# Altium schematic sheet SmartyBoy.SchDoc: SmartyBoy Block Diagram
size A4; DocumentNumber: 1; SheetNumber: 1; SheetTotal: 11
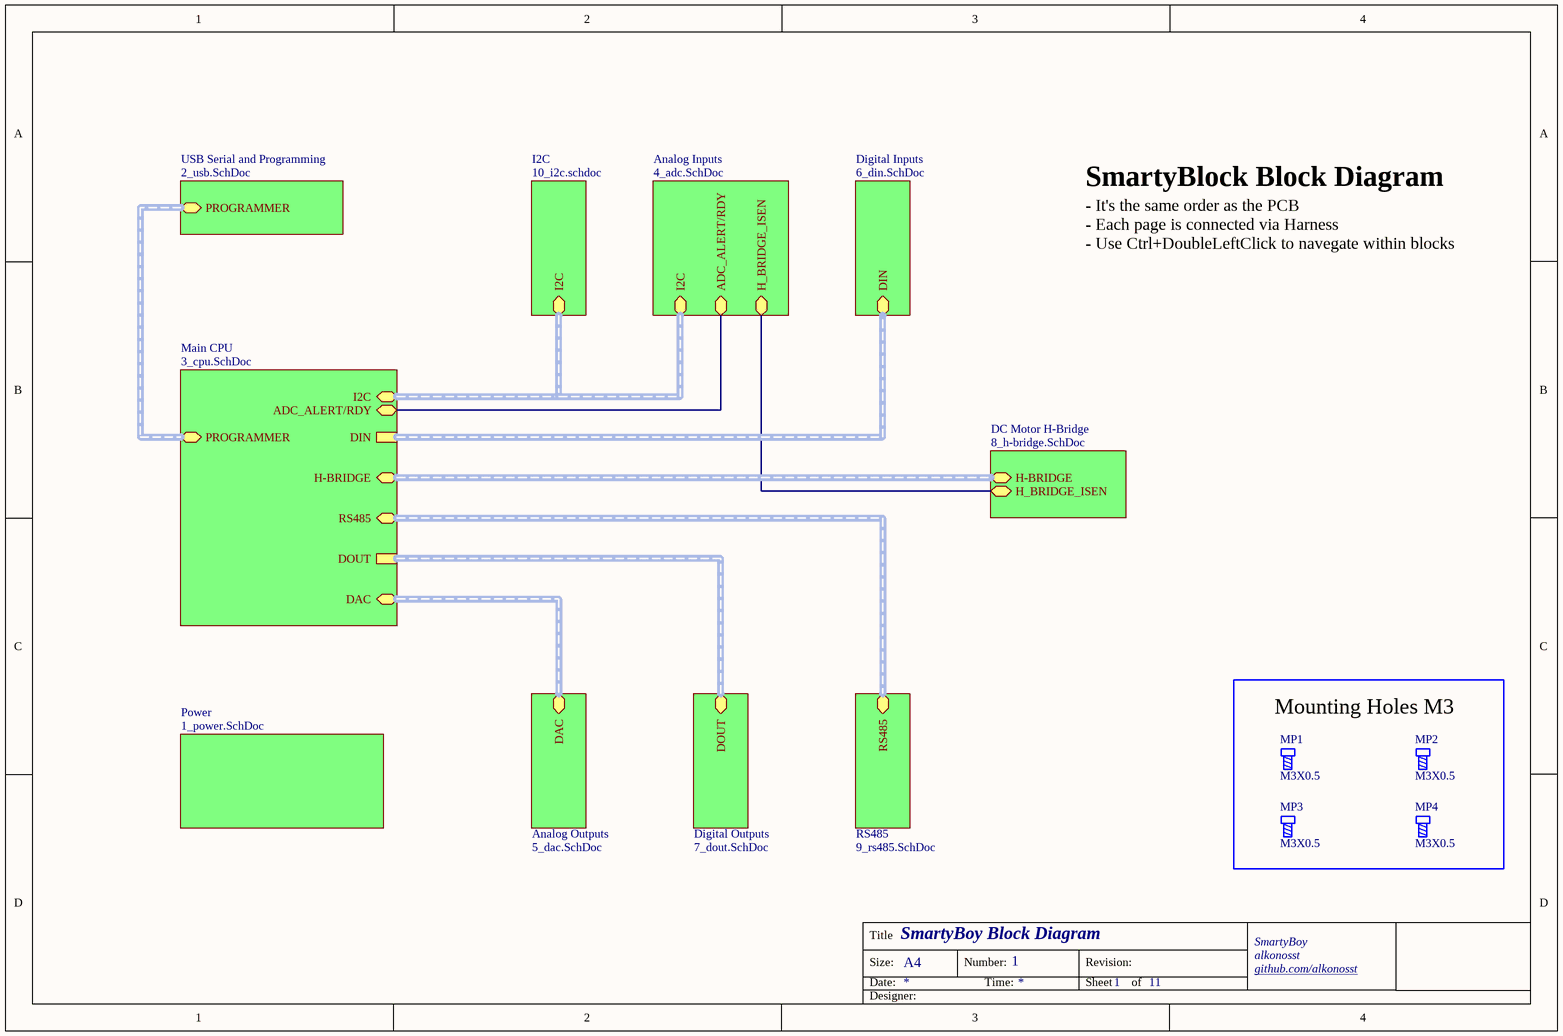
[diagram p0: SmartyBoy.SchDoc]

## Parts
MP1  M3X0.5  [SCREW-M3]  (no BOM)
MP2  M3X0.5  [SCREW-M3]  (no BOM)
MP3  M3X0.5  [SCREW-M3]  (no BOM)
MP4  M3X0.5  [SCREW-M3]  (no BOM)

## Blocks framed on the sheet
Mounting Holes M3: MP1-MP4

## Sub-sheets
Analog Inputs = 4_adc.SchDoc: I2C (bidir, harness I2C), H_BRIDGE_ISEN (bidir), ADC_ALERT/RDY (bidir)
Analog Outputs = 5_dac.SchDoc: DAC (bidir, harness DAC)
DC Motor H-Bridge = 8_h-bridge.SchDoc: H-BRIDGE (bidir, harness DC Motor H-Bridge), H_BRIDGE_ISEN (bidir)
Digital Inputs = 6_din.SchDoc: DIN (bidir, harness Digital Inputs)
Digital Outputs = 7_dout.SchDoc: DOUT (bidir, harness Digital Outputs)
I2C = 10_i2c.schdoc: I2C (bidir, harness I2C)
Main CPU = 3_cpu.SchDoc: PROGRAMMER (bidir, harness ESP32 Programmer), RS485 (bidir, harness RS485), DAC (bidir, harness DAC), I2C (bidir, harness I2C), H-BRIDGE (bidir, harness DC Motor H-Bridge), DOUT (harness Digital Outputs), DIN (harness Digital Inputs), ADC_ALERT/RDY (bidir)
Power = 1_power.SchDoc: no entries
RS485 = 9_rs485.SchDoc: RS485 (bidir, harness RS485)
USB Serial and Programming = 2_usb.SchDoc: PROGRAMMER (bidir, harness ESP32 Programmer)

## Nets
(unnamed): sheet Main CPU/ADC_ALERT/RDY, sheet Analog Inputs/ADC_ALERT/RDY
(unnamed): sheet Analog Inputs/H_BRIDGE_ISEN, sheet DC Motor H-Bridge/H_BRIDGE_ISEN

## Buses and harness runs
harness sheet Analog Inputs/I2C = sheet I2C/I2C = sheet Main CPU/I2C
harness sheet Analog Outputs/DAC = sheet Main CPU/DAC
harness sheet DC Motor H-Bridge/H-BRIDGE = sheet Main CPU/H-BRIDGE
harness sheet Digital Inputs/DIN = sheet Main CPU/DIN
harness sheet Digital Outputs/DOUT = sheet Main CPU/DOUT
harness sheet Main CPU/PROGRAMMER = sheet USB Serial and Programming/PROGRAMMER
harness sheet Main CPU/RS485 = sheet RS485/RS485

## Notes on the sheet
- SmartyBlock Block Diagram
- - It's the same order as the PCB
  - Each page is connected via Harness
  - Use Ctrl+DoubleLeftClick to navegate within blocks
- Title
- Size:
- Date:
- A4
- Number:
- Time:
- Revision:
- Sheet
- of
- SmartyBoy
- alkonosst
- github.com/alkonosst <http://github.com/alkonosst>
- Designer:

## Library data of the parts
MP1-MP4 = SCREW-M3: Mach screw M3X0.5; Category: Accesories